# EAGLE design power (EAGLE 7.4.0)
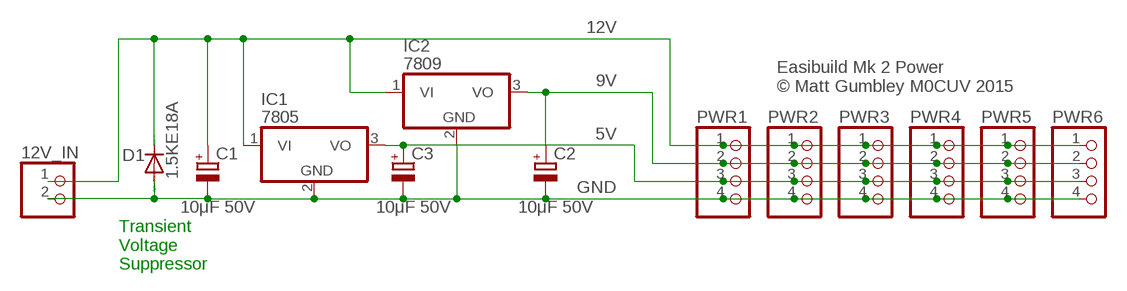
[diagram p0: schematic, sheet 1]

## Parts
12V_IN  PINHD-1X2  [1X02]
C1  10μF 50V  CPOL-EUE2,5-6E  [E2,5-6E]
C2  10μF 50V  CPOL-EUE2,5-6E  [E2,5-6E]
C3  10μF 50V  CPOL-EUE2,5-6E  [E2,5-6E]
D1  1.5KE18A  DIODE-2.54-VC1702-254  [C1702-254]
IC1  7805  7805TV  [TO220V]
IC2  7809  7805TV  [TO220V]
PWR1  PINHD-1X4  [1X04]
PWR2  PINHD-1X4  [1X04]
PWR3  PINHD-1X4  [1X04]
PWR4  PINHD-1X4  [1X04]
PWR5  PINHD-1X4  [1X04]
PWR6  PINHD-1X4  [1X04]

## Nets
5V: C3.+ IC1.3(VO) PWR1.3 PWR2.3 PWR3.3 PWR4.3 PWR5.3 PWR6.3
9V: C2.+ IC2.3(VO) PWR1.2 PWR2.2 PWR3.2 PWR4.2 PWR5.2 PWR6.2
12V: 12V_IN.1 C1.+ D1.C IC1.1(VI) IC2.1(VI) PWR1.1 PWR2.1 PWR3.1 PWR4.1 PWR5.1 PWR6.1
GND: 12V_IN.2 C1.- C2.- C3.- D1.A IC1.2(GND) IC2.2(GND) PWR1.4 PWR2.4 PWR3.4 PWR4.4 PWR5.4 PWR6.4

## Notes on the sheet
- Easibuild Mk 2 Power
  © Matt Gumbley M0CUV 2015
- Transient
  Voltage
  Suppressor

## Library data of the parts
12V_IN = pinhead:PINHD-1X2: PIN HEADER
C1-C3 = rcl:CPOL-EU: POLARIZED CAPACITOR, European symbol
D1 = m0cuv-custom:DIODE-2.54-V
IC1 IC2 = linear:78*: Positive VOLTAGE REGULATOR Source: http://cache.national.com/ds/LM/LM78L05.pdf http://www.fairchildsemi.com/ds/LM/LM7805.pdf
PWR1-PWR6 = pinhead:PINHD-1X4: PIN HEADER

## Board
Easibuild Mk 2 Power Board // Matt Gumbley M0CUV
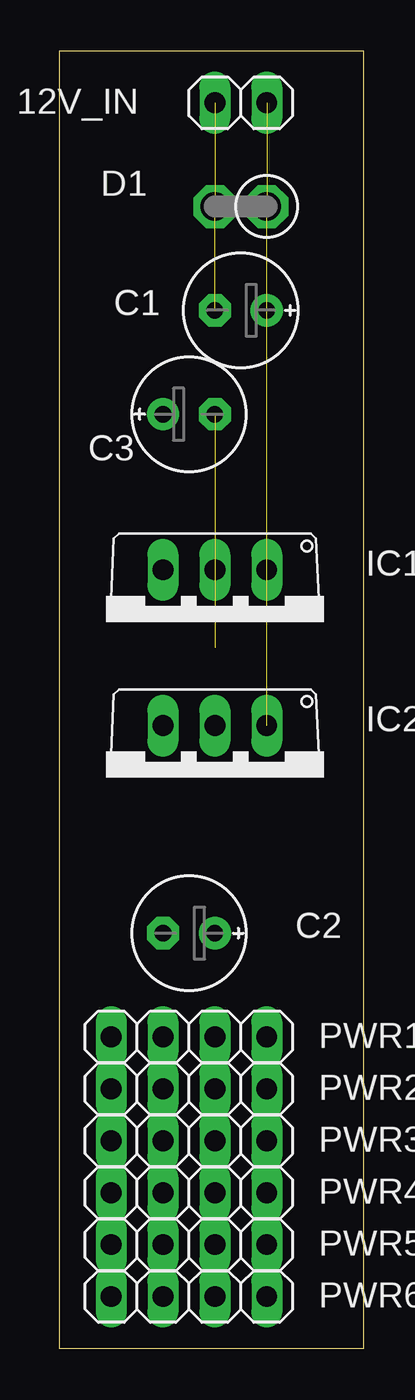
[diagram p1: board, top side]
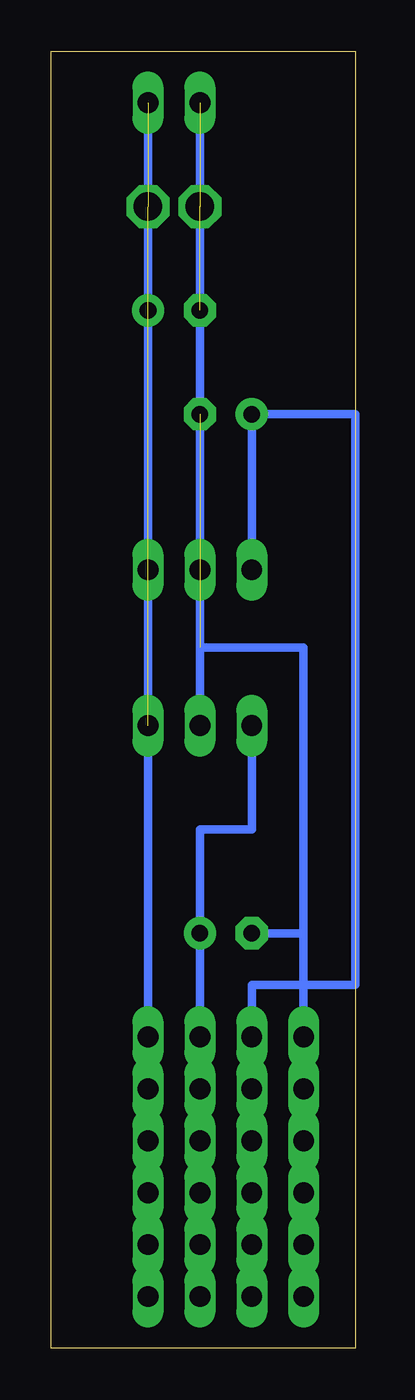
[diagram p2: board, bottom side, seen from below]

Size 14.91 x 63.49 mm. Coordinates in mm from the lower left corner, seen from the top.
Outline: 0,0 14.91,0 14.91,63.49 0,63.49 0,0
Copper layers (1*16): Top 0.035mm / dielectric 1.5mm / Bottom 0.035mm
Design rules "default": minimum track width 10mil, minimum drill 24mil, track to track 8mil, track to pad 8mil, pad to pad 8mil, via to via 8mil, smd to smd 8mil, copper to edge 40mil, drill to drill 8mil, minimum pad ring 10mil, minimum via ring 8mil, stop-mask expansion 4mil, vias tented up to drill 0mil, thermal gap 10mil

### Footprints (pad centres in the part's own frame; a part is rotated, then mirrored left to right if it is on the bottom)
1X02 = drill 1.016 long: 1 -1.27,0; 2 1.27,0
E2,5-6E = drill 0.813 pad 1.575: + -1.27,0 | drill 0.813 pad 1.575 octagon: - 1.27,0
C1702-254 = drill 1.397 octagon: A 0,0; C -2.54,0
TO220V = drill 1.016 long: 1 -2.54,-2.54; 2 0,-2.54; 3 2.54,-2.54
1X04 = drill 1.016 long: 1 -3.81,0; 2 -1.27,0; 3 1.27,0; 4 3.81,0

### Placement (x,y rotation side)
12V_IN  8.89,60.96 180 top
C1  8.89,50.8 180 top
C2  6.35,20.32 180 top
C3  6.35,45.72 0 top
D1  7.62,55.88 180 top
IC1  7.62,35.56 180 top
IC2  7.62,27.94 180 top
PWR1  6.35,15.24 180 top
PWR2  6.35,12.7 180 top
PWR3  6.35,10.16 180 top
PWR4  6.35,7.62 180 top
PWR5  6.35,5.08 180 top
PWR6  6.35,2.54 180 top

### Tracks (layer width: path | path; a pad name or v marks a point on that pad's centre or on a via)
5V
  Bottom 0.406: IC1.3 C3.+ 0,45.72 0,17.78 5.08,17.78 PWR1.3 PWR2.3 PWR3.3 PWR4.3 PWR5.3 PWR6.3
9V
  Bottom 0.406: IC2.3 5.08,25.4 7.62,25.4 C2.+ PWR1.2 PWR2.2 PWR3.2 PWR4.2 PWR5.2 PWR6.2
12V  (4 unrouted)
  Bottom 0.406: 12V_IN.1 PWR1.1 PWR2.1 PWR3.1 PWR4.1 PWR5.1 PWR6.1
GND  (4 unrouted)
  Bottom 0.406: 12V_IN.2 7.62,34.29 | 7.62,34.29 IC2.2 | 2.54,20.32 PWR1.4 PWR2.4 PWR3.4 PWR4.4 PWR5.4 PWR6.4 | 2.54,20.32 2.54,34.29 7.62,34.29 | C2.- 2.54,20.32

### Text on the board
Document: Easibuild Mk 2 Power / © Matt Gumbley M0CUV 2015